# EAGLE schematic schematic (EAGLE 9.3.2)
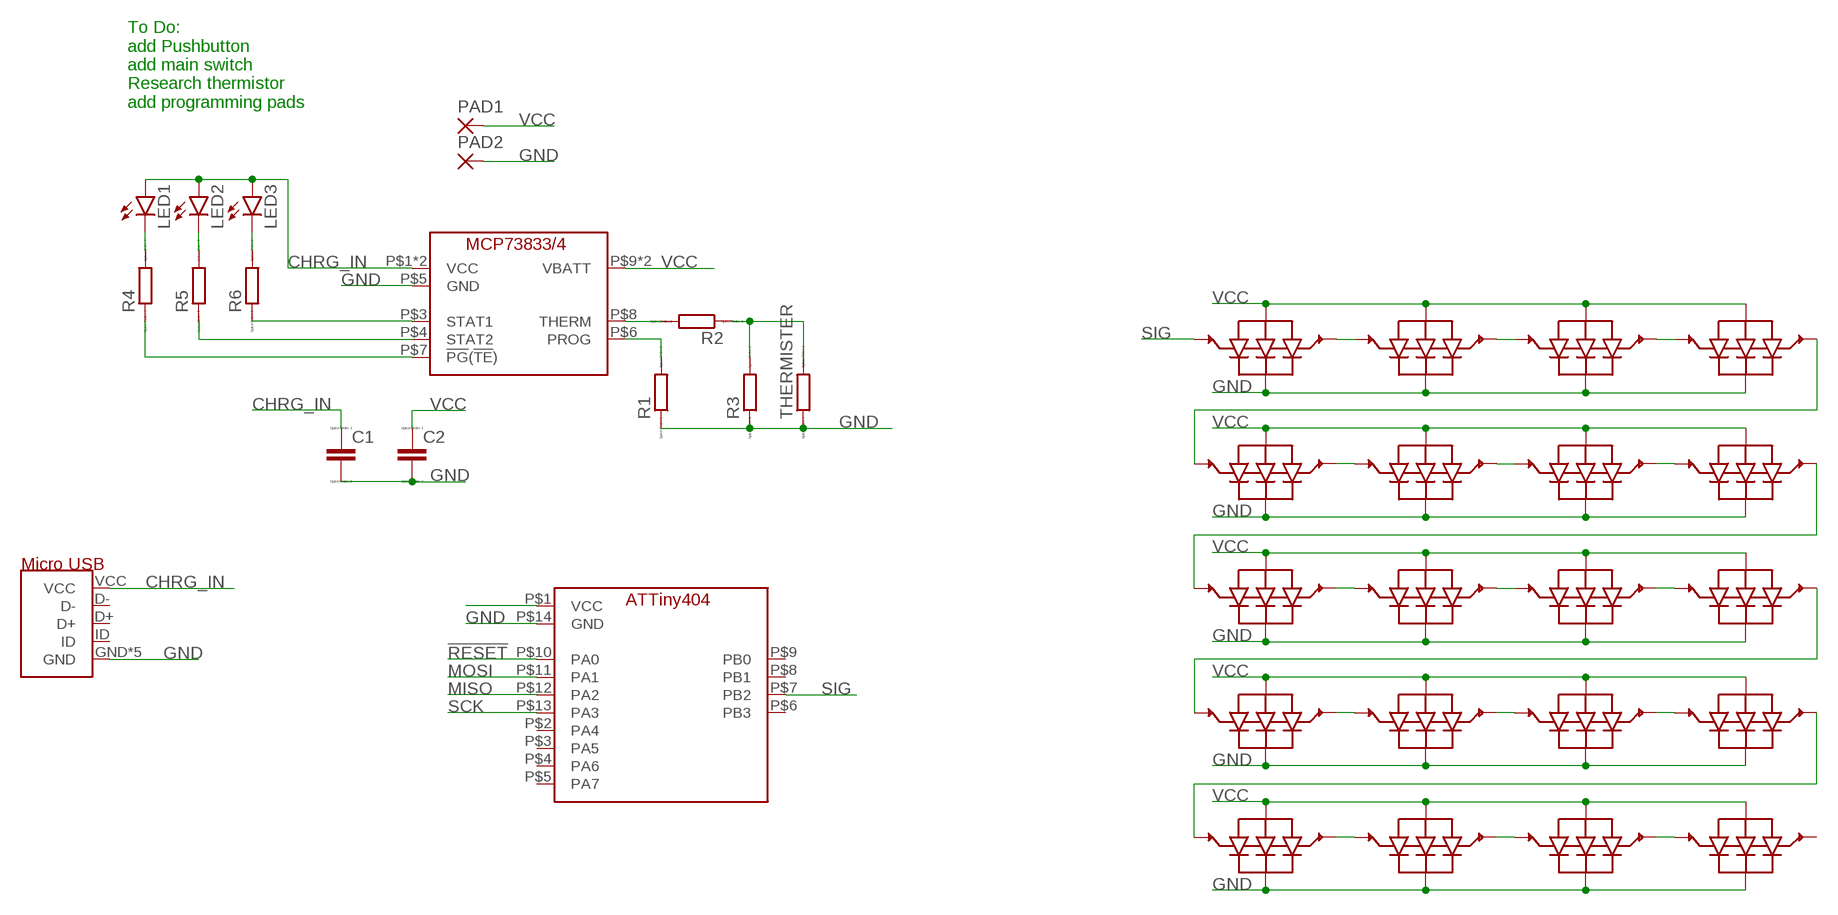
[diagram p0: schematic, sheet 1]

## Parts
C1  CC1206  [C1206]
C2  CC1206  [C1206]
LED1  LEDSML1206  [SML1206]
LED2  LEDSML1206  [SML1206]
LED3  LEDSML1206  [SML1206]
PAD1  1,6/0,8  [1,6/0,8]
PAD2  1,6/0,8  [1,6/0,8]
R1  RR1206  [R1206]
R2  RR1206  [R1206]
R3  RR1206  [R1206]
R4  RR1206  [R1206]
R5  RR1206  [R1206]
R6  RR1206  [R1206]
THERMISTER  RR1206  [R1206]
U$1  ATTINY404  [14-SOIC]
U$2  MCP73833/4  [10-MSOP]
U$3  WS2812B  [5050-THRU]
U$4  WS2812B  [5050-THRU]
U$5  WS2812B  [5050-THRU]
U$6  WS2812B  [5050-THRU]
U$7  WS2812B  [5050-THRU]
U$8  WS2812B  [5050-THRU]
U$9  WS2812B  [5050-THRU]
U$10  WS2812B  [5050-THRU]
U$11  WS2812B  [5050-THRU]
U$12  WS2812B  [5050-THRU]
U$13  WS2812B  [5050-THRU]
U$14  WS2812B  [5050-THRU]
U$15  WS2812B  [5050-THRU]
U$16  WS2812B  [5050-THRU]
U$17  WS2812B  [5050-THRU]
U$18  WS2812B  [5050-THRU]
U$19  WS2812B  [5050-THRU]
U$20  WS2812B  [5050-THRU]
U$21  WS2812B  [5050-THRU]
U$22  WS2812B  [5050-THRU]
U$23  MICROUSB  [MICROUSB]

## Nets
!RESET: U$1.P$10(PA0)
CHRG_IN: C1.1 LED1.A LED2.A LED3.A U$2.P$1(VCC) U$2.P$2(VCC) U$23.VCC
GND: C1.2 C2.2 PAD2.1(P) R1.1 R3.1 THERMISTER.1 U$1.P$14(GND) U$2.P$5(GND) U$3.P$3(GND) U$4.P$3(GND) U$5.P$3(GND) U$6.P$3(GND) U$7.P$3(GND) U$8.P$3(GND) U$9.P$3(GND) U$10.P$3(GND) U$11.P$3(GND) U$12.P$3(GND) U$13.P$3(GND) U$14.P$3(GND) U$15.P$3(GND) U$16.P$3(GND) U$17.P$3(GND) U$18.P$3(GND) U$19.P$3(GND) U$20.P$3(GND) U$21.P$3(GND) U$22.P$3(GND) U$23.GND U$23.GND2(GND) U$23.GND3(GND) U$23.GND4(GND) U$23.GND5(GND)
MISO: U$1.P$12(PA2)
MOSI: U$1.P$11(PA1)
N$1: U$3.P$2(DOUT) U$4.P$4(DIN)
N$2: U$7.P$2(DOUT) U$8.P$4(DIN)
N$3: R1.2 U$2.P$6(PROG)
N$4: R2.2 U$2.P$8(THERM)
N$5: R2.1 R3.2 THERMISTER.2
N$6: LED1.C R4.2
N$7: LED2.C R5.2
N$8: R6.1 U$2.P$3(STAT1)
N$9: LED3.C R6.2
N$10: U$13.P$2(DOUT) U$19.P$4(DIN)
N$11: U$5.P$2(DOUT) U$6.P$4(DIN)
N$12: U$9.P$2(DOUT) U$14.P$4(DIN)
N$13: U$17.P$2(DOUT) U$18.P$4(DIN)
N$14: R5.1 U$2.P$4(STAT2)
N$15: U$10.P$2(DOUT) U$11.P$4(DIN)
N$16: U$11.P$2(DOUT) U$12.P$4(DIN)
N$17: U$12.P$2(DOUT) U$13.P$4(DIN)
N$18: U$4.P$2(DOUT) U$5.P$4(DIN)
N$19: U$8.P$2(DOUT) U$9.P$4(DIN)
N$20: U$16.P$2(DOUT) U$17.P$4(DIN)
N$21: U$21.P$2(DOUT) U$22.P$4(DIN)
N$22: U$20.P$2(DOUT) U$21.P$4(DIN)
N$23: U$15.P$2(DOUT) U$16.P$4(DIN)
N$24: U$18.P$2(DOUT) U$20.P$4(DIN)
N$25: U$14.P$2(DOUT) U$15.P$4(DIN)
N$26: U$6.P$2(DOUT) U$7.P$4(DIN)
N$27: U$3.P$4(DIN) U$19.P$2(DOUT)
N$28: R4.1 U$2.P$7(!PG!(!TE!))
N$29: U$1.P$1(VCC)
SCK: U$1.P$13(PA3)
SIG: U$1.P$7(PB2) U$10.P$4(DIN)
VCC: C2.1 PAD1.1(P) U$2.P$9(VBATT) U$2.P$10(VBATT) U$3.P$1(VCC) U$4.P$1(VCC) U$5.P$1(VCC) U$6.P$1(VCC) U$7.P$1(VCC) U$8.P$1(VCC) U$9.P$1(VCC) U$10.P$1(VCC) U$11.P$1(VCC) U$12.P$1(VCC) U$13.P$1(VCC) U$14.P$1(VCC) U$15.P$1(VCC) U$16.P$1(VCC) U$17.P$1(VCC) U$18.P$1(VCC) U$19.P$1(VCC) U$20.P$1(VCC) U$21.P$1(VCC) U$22.P$1(VCC)
Unconnected: U$1.P$2(PA4) U$1.P$3(PA5) U$1.P$4(PA6) U$1.P$5(PA7) U$1.P$6(PB3) U$1.P$8(PB1) U$1.P$9(PB0) U$22.P$2(DOUT) U$23.D+ U$23.D- U$23.ID

## Notes on the sheet
- To Do:
  add Pushbutton
  add main switch
  Research thermistor
  add programming pads

## Library data of the parts
C1 C2 = eagle-ltspice:C: CAPACITOR, European symbol; SPICEMODEL: NONE; SPICEPREFIX: C
LED1-LED3 = led:LED: LED OSRAM: - CHIPLED LG R971, LG N971, LY N971, LG Q971, LY Q971, LO R971, LY R971 LH N974, LH R974 LS Q976, LO Q976, LY Q976 LO Q996 - Hyper CHIPLED LW Q18S LB Q993, LB Q99A, LB R99A - SideLED LS A670, LO A670, LY A670, LG A670, LP A670 LB A673, LV A673, LT A673, LW A673 LH A674 LY A675 LS A676, LA A676, LO A676, LY A676, LW A676 LS A679, LY A679, LG A679 - Hyper Micro SIDELED® LS Y876, LA Y876, LO Y876, LY Y876 LT Y87S - SmartLED LW L88C, LW L88S LB L89C, LB L89S, LG L890 LS L89K, LO L89K, LY L89K LS L896, LA L896, LO L896, LY L896 - TOPLED LS T670, LO T670, LY T670, LG T670, LP T670 LSG T670, LSP T670, LSY T670, LOP T670, LYG T670 LG T671, LOG T671, LSG T671 LB T673, LV T673, LT T673, LW T673 LH T674 LS T676, LA T676, LO T676, LY T676, LB T676, LH T676, LSB T676, LW T676 LB T67C, LV T67C, LT T67C, LS T67K, LO T67K, LY T67K, LW E67C LS E67B, LA E67B, LO E67B, LY E67B, LB E67C, LV E67C, LT E67C LW T67C LS T679, LY T679, LG T679 LS T770, LO T770, LY T770, LG T770, LP T770 LB T773, LV T773, LT T773, LW T773 LH T774 LS E675, LA E675, LY E675, LS T675 LS T776, LA T776, LO T776, LY T776, LB T776 LHGB T686 LT T68C, LB T68C - Hyper Mini TOPLED® LB M676 - Mini TOPLED Santana® LG M470 LS M47K, LO M47K, LY M47K Source: http://www.osram.convergy.de LUXEON: - LUMILED® LXK2-PW12-R00, LXK2-PW12-S00, LXK2-PW14-U00, LXK2-PW14-V00 LXK2-PM12-R00, LXK2-PM12-S00, LXK2-PM14-U00 LXK2-PE12-Q00, LXK2-PE12-R00, LXK2-PE12-S00, LXK2-PE14-T00, LXK2-PE14-U00 LXK2-PB12-K00, LXK2-PB12-L00, LXK2-PB12-M00, LXK2-PB14-N00, LXK2-PB14-P00, LXK2-PB14-Q00 LXK2-PR12-L00, LXK2-PR12-M00, LXK2-PR14-Q00, LXK2-PR14-R00 LXK2-PD12-Q00, LXK2-PD12-R00, LXK2-PD12-S00 LXK2-PH12-R00, LXK2-PH12-S00 LXK2-PL12-P00, LXK2-PL12-Q00, LXK2-PL12-R00 Source: www.luxeon.com KINGBRIGHT: KA-3528ASYC Source: www.kingbright.com
PAD1 PAD2 = wirepad:1,6/0,8: THROUGH-HOLE PAD
R1-R6 THERMISTER = eagle-ltspice:R: RESISTOR, European symbol; SPICEMODEL: NONE; SPICEPREFIX: R
U$1 = Library:ATTINY404
U$2 = Library:MCP73833/4
U$3-U$22 = Library:WS2812B
U$23 = Library:MICROUSB